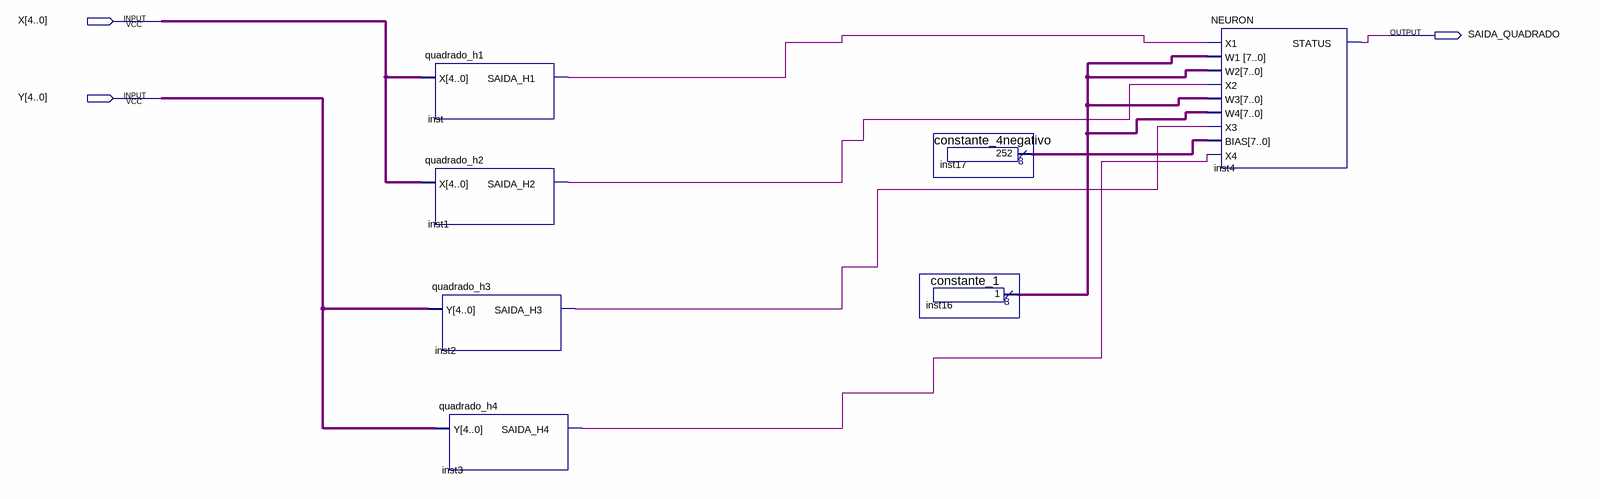
[diagram p0: schematic sheet]
// Quartus schematic mlp_quadrado.bdf as structural Verilog: 7 symbols, 3 pins
module mlp_quadrado (
  input  [4:0] X,
  input  [4:0] Y,
  output SAIDA_QUADRADO
);

  wire inst1_saida_h2, inst2_saida_h3, inst3_saida_h4, inst_saida_h1;
  wire [7:0] inst16_result, inst17_result;

  quadrado_h1 inst (.X(X), .SAIDA_H1(inst_saida_h1));
  quadrado_h2 inst1 (.X(X), .SAIDA_H2(inst1_saida_h2));
  quadrado_h3 inst2 (.Y(Y), .SAIDA_H3(inst2_saida_h3));
  quadrado_h4 inst3 (.Y(Y), .SAIDA_H4(inst3_saida_h4));
  constante_1 inst16 (.result(inst16_result));
  constante_4negativo inst17 (.result(inst17_result));
  NEURON inst4 (
    .X1(inst_saida_h1), .W1(inst16_result), .W2(inst16_result), .X2(inst1_saida_h2), .W3(inst16_result),
    .W4(inst16_result), .X3(inst2_saida_h3), .BIAS(inst17_result), .X4(inst3_saida_h4),
    .STATUS(SAIDA_QUADRADO));
endmodule
